# EAGLE design untitled (EAGLE 9.1.3)
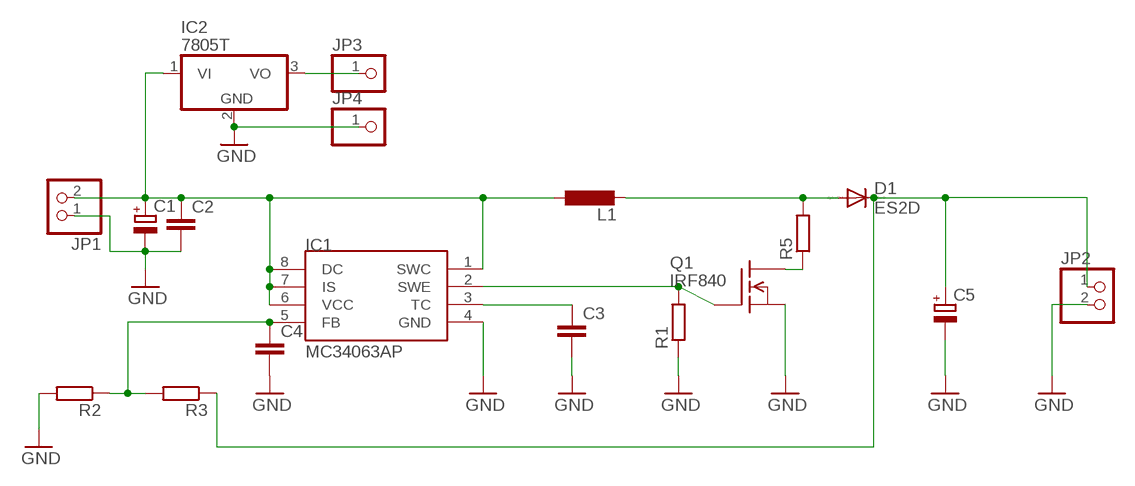
[diagram p0: schematic, sheet 1]

## Parts
C1  CPOL-EUE3.5-8  [E3,5-8]
C2  C-EU050-025X075  [C050-025X075]
C3  C-EU050-025X075  [C050-025X075]
C4  C-EU050-025X075  [C050-025X075]
C5  CPOL-EUE3.5-8  [E3,5-8]
D1  ES2D  [SMB]
IC1  MC34063AP  [DIL08]
IC2  7805T  [TO220H]
JP1  PINHD-1X2  [1X02]
JP2  PINHD-1X2  [1X02]
JP3  PINHD-1X1  [1X01]
JP4  PINHD-1X1  [1X01]
L1  L-EUTJ3-U1  [TJ3-U1]
Q1  IRF840  [TO220]
R1  R-EU_0207/7  [0207/7]
R2  R-EU_0207/7  [0207/7]
R3  R-EU_0207/7  [0207/7]
R5  R-EU_0207/15  [0207/15]

## Nets
GND: C1.- C2.2 C3.2 C4.2 C5.- IC1.4(GND) IC2.2(GND) JP1.1 JP2.2 JP4.1 Q1.3(S) R1.1 R2.2
N$1: C1.+ C2.1 IC1.1(SWC) IC1.6(VCC) IC1.7(IS) IC1.8(DC) IC2.1(VI) JP1.2 L1.1
N$2: C4.1 IC1.5(FB) R2.1 R3.2
N$3: C3.1 IC1.3(TC)
N$4: D1.A L1.2 R5.2
N$5: IC1.2(SWE) Q1.1(G) R1.2
N$6: Q1.2(D) R5.1
N$7: C5.+ D1.C JP2.1 R3.1
N$8: IC2.3(VO) JP3.1

## Library data of the parts
C1 C5 = rcl:CPOL-EU: POLARIZED CAPACITOR, European symbol; SPICEPREFIX: C
C2-C4 = rcl:C-EU: CAPACITOR, European symbol; SPICEPREFIX: C
D1 = diode:ES2D: DIODE super fast rectifier, 2 A
IC1 = mc34063:MC34063
IC2 = linear:78*: Positive VOLTAGE REGULATOR Source: http://cache.national.com/ds/LM/LM78L05.pdf http://www.fairchildsemi.com/ds/LM/LM7805.pdf
JP1 JP2 = pinhead:PINHD-1X2: PIN HEADER
JP3 JP4 = pinhead:PINHD-1X1: PIN HEADER
L1 = rcl:L-EU: INDUCTOR, European symbol; SPICEPREFIX: L
Q1 = transistor-fet:IRF840: N-Channel Enhancement MOSFET (HEXFET); 500V; 8A; 0,85Ohm
R1-R3 R5 = rcl:R-EU_: RESISTOR, European symbol; SPICEPREFIX: R

## Board
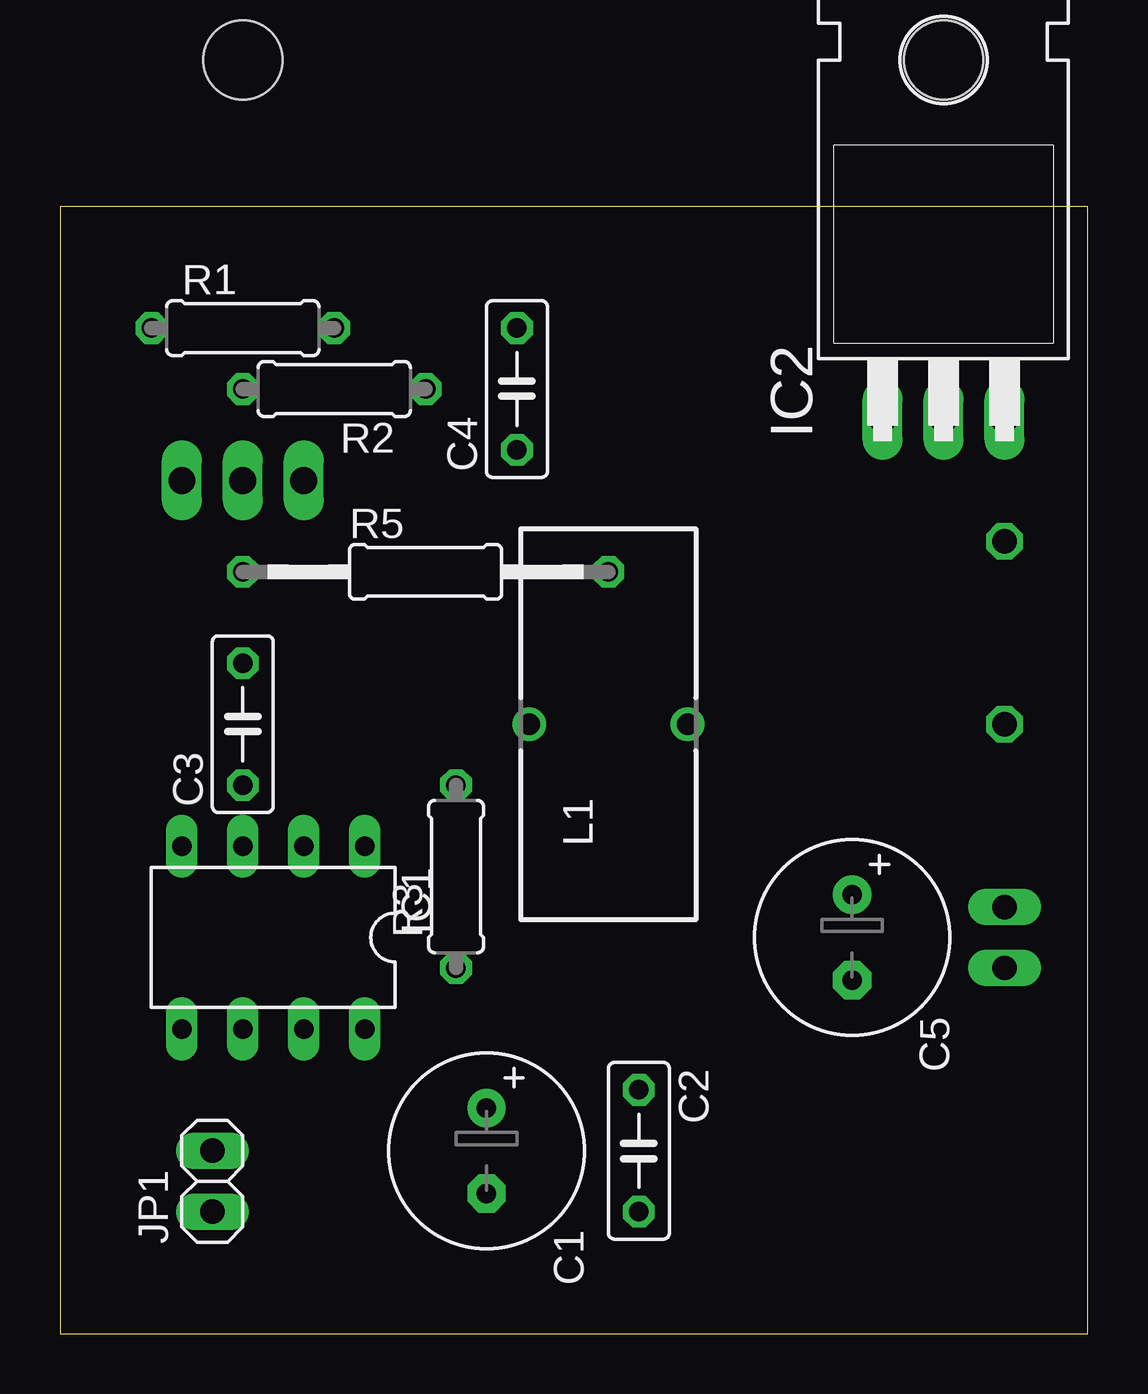
[diagram p1: board, top side]
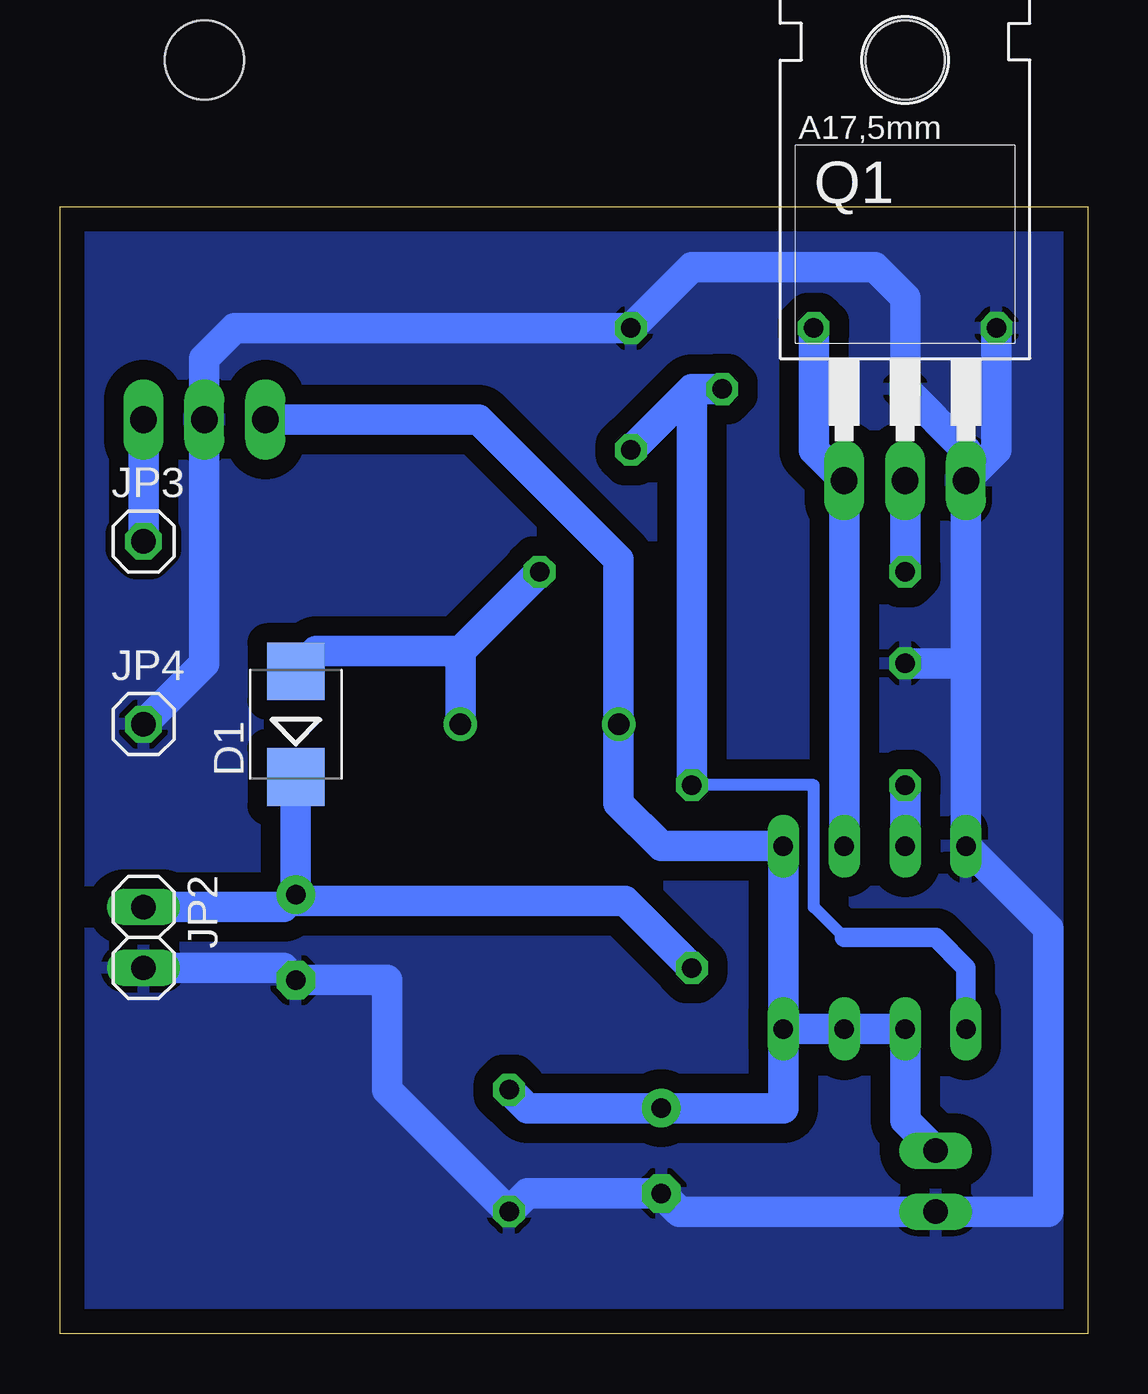
[diagram p2: board, bottom side, seen from below]

Size 42.85 x 46.98 mm. Coordinates in mm from the lower left corner, seen from the top.
Outline: 0,0 42.85,0 42.85,46.98 0,46.98 0,0
Copper layers (1*16): Top 0.035mm / dielectric 1.5mm / Bottom 0.035mm
Design rules "default": minimum track width 6mil, minimum drill 0.35mm, track to track 6mil, track to pad 6mil, pad to pad 6mil, via to via 6mil, smd to smd 6mil, copper to edge 40mil, drill to drill 6mil, minimum pad ring 10mil, minimum via ring 8mil, stop-mask expansion 4mil, vias tented up to drill 0mil, thermal gap 10mil

### Footprints (pad centres in the part's own frame; a part is rotated, then mirrored left to right if it is on the bottom)
E3,5-8 = drill 0.813 pad 1.6: + -1.778,0 | drill 0.813 pad 1.6 octagon: - 1.778,0
C050-025X075 = drill 0.813 octagon: 1 -2.54,0; 2 2.54,0
SMB = smd 2.4 x 2.4: A 2.2,0; C -2.2,0
DIL08 = drill 0.813 long: 1 -3.81,-3.81; 2 -1.27,-3.81; 3 1.27,-3.81; 4 3.81,-3.81; 5 3.81,3.81; 6 1.27,3.81; 7 -1.27,3.81; 8 -3.81,3.81
TO220H = drill 1.118 long: 1 -2.54,-10.16; 2 0,-10.16; 3 2.54,-10.16 | hole 3.302: 0,4.826
1X02 = drill 1.016 long: 1 -1.27,0; 2 1.27,0
1X01 = drill 1.016 octagon: 1 0,0
TJ3-U1 = drill 0.9: 1 -3.3,0; 2 3.3,0
TO220 = drill 1.118 long: 1 -2.54,-6.35; 2 0,-6.35; 3 2.54,-6.35 | hole 3.302: 0,11.176
0207/7 = drill 0.813 octagon: 1 -3.81,0; 2 3.81,0
0207/15 = drill 0.813 octagon: 1 -7.62,0; 2 7.62,0

### Placement (x,y rotation side)
C1  17.78,7.62 270 top
C2  24.13,7.62 270 top
C3  7.62,25.4 90 top
C4  19.05,39.37 90 top
C5  33.02,16.51 270 top
D1  33.02,25.4 90 bottom
IC1  8.89,16.51 180 top
IC2  36.83,48.26 0 top
JP1  6.35,6.35 90 top
JP2  39.37,16.51 270 bottom
JP3  39.37,33.02 0 bottom
JP4  39.37,25.4 0 bottom
L1  22.86,25.4 0 top
Q1  7.62,41.91 0 bottom
R1  7.62,41.91 0 top
R2  11.43,39.37 180 top
R3  16.51,19.05 90 top
R5  15.24,31.75 0 top

### Tracks (layer width: path | path; a pad name or v marks a point on that pad's centre or on a via)
GND
  Bottom 0.152: 5.08,36.83 Q1.3 | 33.53,15.24 C5.- | 6.86,4.57 JP1.1 | C2.2 24.64,5.08
  Bottom 1.27: R1.1 3.81,36.83 Q1.3 5.08,27.94 | C3.2 5.08,27.94 | 5.08,36.83 R2.2 7.62,43.18 8.89,44.45 16.51,44.45 C4.2 35.56,41.91 36.83,40.64 IC2.2 36.83,27.94 JP4.1 | JP2.2 33.53,15.24 | 5.08,27.94 IC1.4 1.65,16.89 1.65,5.08 JP1.1 17.02,5.08 C1.- 23.37,5.84 C2.2 29.21,10.16 29.21,14.73 C5.-
  pour Bottom (isolate 0.813): 0,46.99 43.18,46.99 43.18,0 0,0
N$1
  Bottom 1.27: IC1.8 IC1.7 IC1.6 7.62,8.89 JP1.2 | IC1.8 IC1.1 17.78,20.32 19.56,22.1 L1.1 19.56,32.26 25.4,38.1 IC2.1 | IC1.8 12.7,9.4 C1.+ 23.37,9.4 C2.1
N$2
  Bottom 0.508: 10.16,16.51 11.43,17.78 11.43,22.86 R3.2
  Bottom 0.813: 10.16,16.51 6.35,16.51 5.08,15.24 IC1.5
  Bottom 1.27: C4.1 16.51,39.37 | 16.51,39.37 R2.1 | 16.51,39.37 R3.2
N$3
  Bottom 1.27: C3.1 IC1.3
N$4
  Bottom 0.152: D1.A 32.17,28.45
  Bottom 1.27: R5.2 26.16,28.45 | 26.16,28.45 L1.2 | 32.17,28.45 26.16,28.45
N$5
  Bottom 1.27: R1.2 11.43,36.83 Q1.1 IC1.2
N$6
  Bottom 1.27: R5.1 Q1.2
N$7
  Bottom 0.152: 33.53,17.78 33.27,18.03 C5.+
  Bottom 1.27: JP2.1 33.53,17.78 | D1.C C5.+ | R3.1 19.3,18.03 33.27,18.03
N$8
  Bottom 1.27: IC2.3 JP3.1